# Altium schematic sheet PowerDiagram.SchDoc
size A; SheetNumber: 2; SheetTotal: 5
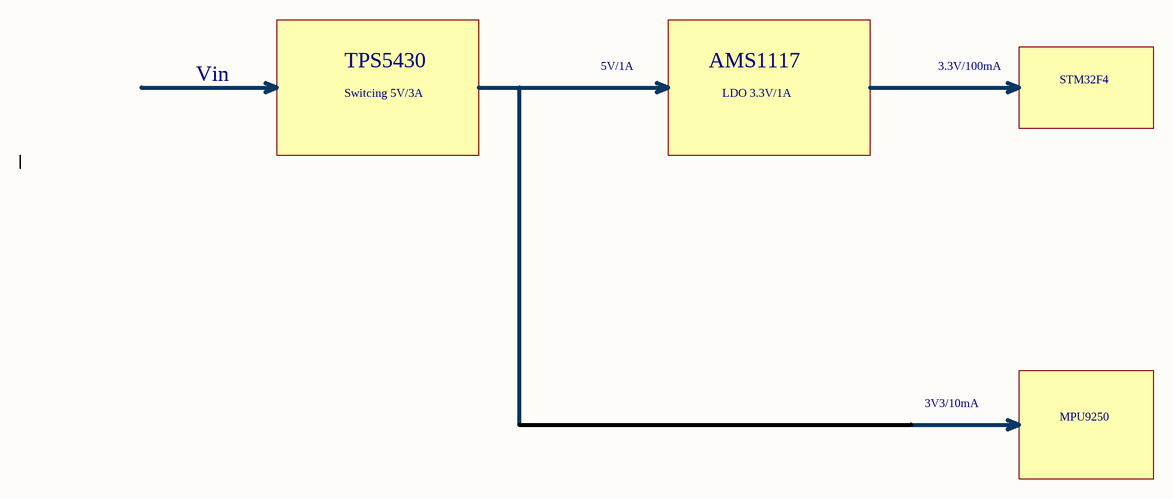
[diagram p0: PowerDiagram.SchDoc]

## Notes on the sheet
- Vin
- TPS5430
- Switcing 5V/3A
- 5V/1A
- AMS1117
- LDO 3.3V/1A
- 3.3V/100mA
- STM32F4
- 3V3/10mA
- MPU9250